# EAGLE design FBMiniLEDStrip (EAGLE 7.7.0)
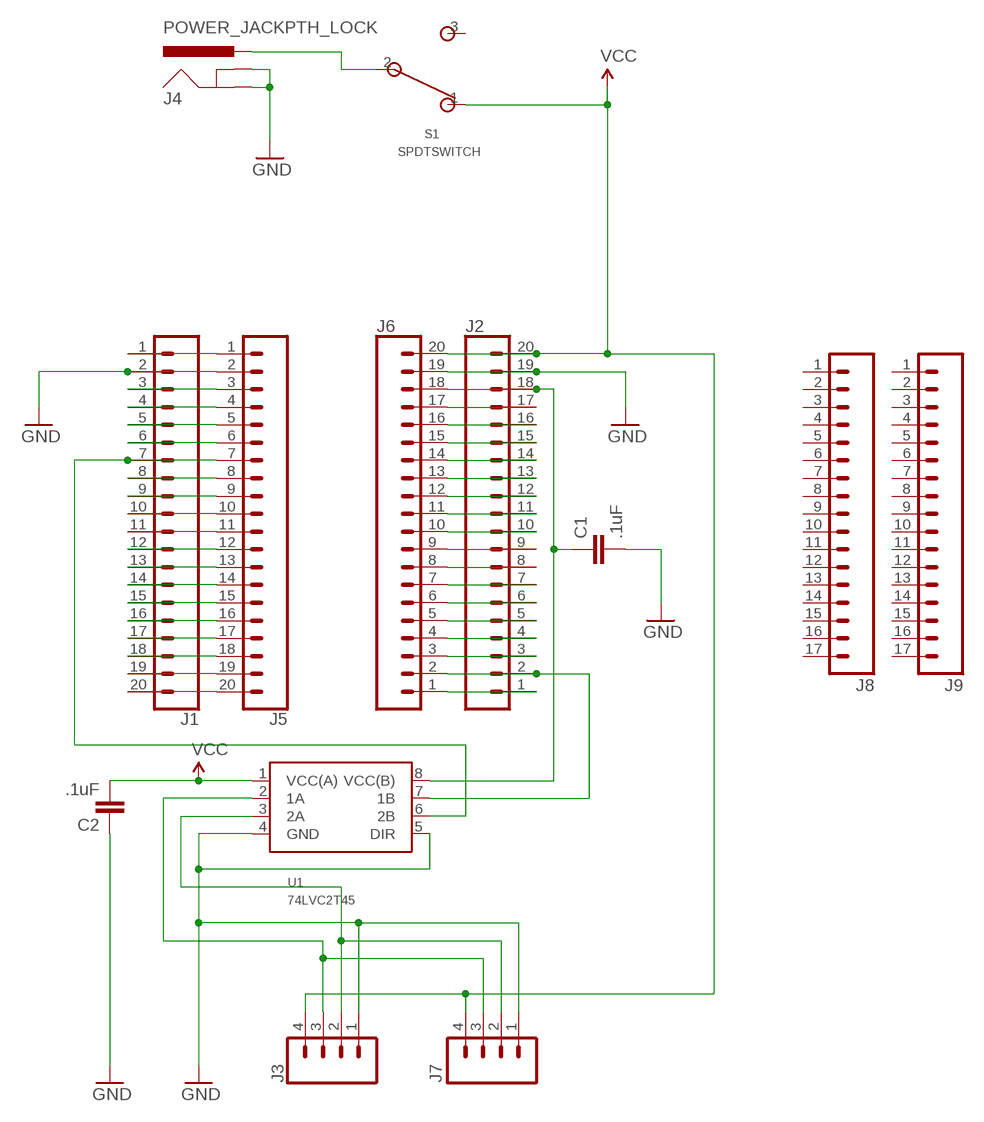
[diagram p0: schematic, sheet 1]

## Parts
C1  .1uF  CAP0603-CAP  [0603-CAP]
C2  .1uF  CAP0603-CAP  [0603-CAP]
J1  CONN_20  [1X20]
J2  CONN_20  [1X20]
J3  CONN_04SCREW  [SCREWTERMINAL-3.5MM-4@1]
J4  POWER_JACKPTH_LOCK  [POWER_JACK_PTH_LOCK]
J5  CONN_20  [1X20]
J6  CONN_20  [1X20]
J7  M04PTH  [1X04]
J8  M17  [1X17]
J9  M17  [1X17]
S1  SPDTSWITCH  [100SP1T1B4M2QE]
U1  74LVC2T45  [VSSOP8]

## Nets
GND: C1.2 C2.1 J1.2 J2.19 J3.1 J4.GND J4.GNDBREAK J5.2 J6.19 J7.1 U1.4(GND) U1.5(DIR)
N$3: J1.1 J5.1
N$4: J3.2 J7.2 U1.3(2A)
N$5: J1.3 J5.3
N$6: J1.4 J5.4
N$7: J1.5 J5.5
N$8: J1.6 J5.6
N$9: J1.7 J5.7 U1.6(2B)
N$10: J1.8 J5.8
N$11: J1.9 J5.9
N$12: J1.10 J5.10
N$13: J1.11 J5.11
N$14: J1.12 J5.12
N$15: J1.13 J5.13
N$16: J1.14 J5.14
N$17: J1.15 J5.15
N$18: J1.16 J5.16
N$19: J1.17 J5.17
N$20: J1.18 J5.18
N$21: J1.19 J5.19
N$22: J1.20 J5.20
N$23: J3.3 J7.3 U1.2(1A)
N$25: C1.1 J2.18 J6.18 U1.8(VCC(B))
N$26: J2.17 J6.17
N$27: J2.16 J6.16
N$28: J2.15 J6.15
N$29: J2.14 J6.14
N$30: J2.13 J6.13
N$31: J2.12 J6.12
N$32: J2.11 J6.11
N$33: J2.10 J6.10
N$34: J2.9 J6.9
N$35: J2.8 J6.8
N$36: J2.7 J6.7
N$37: J2.6 J6.6
N$38: J2.5 J6.5
N$39: J2.4 J6.4
N$40: J2.3 J6.3
N$41: J2.2 J6.2 U1.7(1B)
N$42: J2.1 J6.1
N$43: J4.PWR S1.2
VCC: C2.2 J2.20 J3.4 J6.20 J7.4 S1.1 U1.1(VCC(A))
Unconnected: J8.1 J8.2 J8.3 J8.4 J8.5 J8.6 J8.7 J8.8 J8.9 J8.10 J8.11 J8.12 J8.13 J8.14 J8.15 J8.16 J8.17 J9.1 J9.2 J9.3 J9.4 J9.5 J9.6 J9.7 J9.8 J9.9 J9.10 J9.11 J9.12 J9.13 J9.14 J9.15 J9.16 J9.17 S1.3

## Library data of the parts
C1 C2 = SparkFun-Capacitors:CAP: Capacitor Standard 0603 ceramic capacitor, and 0.1" leaded capacitor.
J1 J2 J5 J6 = SparkFun-Connectors:CONN_20: Multi connection point. Often used as Generic Header-pin footprint for 0.1 inch spaced/style header connections On any of the 0.1 inch spaced packages, you can populate with these: Break Away Headers - Straight <https://www.sparkfun.com/products/116> (PRT-00116) Break Away Male Headers - Right Angle <https://www.sparkfun.com/products/553> (PRT-00553) Female Headers <https://www.sparkfun.com/products/115> (PRT-00115) Break Away Headers - Machine Pin <https://www.sparkfun.com/products/117> (PRT-00117) Break Away Female Headers - Swiss Machine Pin <https://www.sparkfun.com/products/743> (PRT-00743) For SCREWTERMINALS and SPRING TERMINALS visit here: Screw Terimnals on SparkFun.com <https://www.sparkfun.com/search/results?term=Screw+Terminals> (5mm/3.5mm/2.54mm spacing) This device is also useful as a general connection point to wire up your design to another part of your project. Our various solder wires solder well into these plated through hole pads. Hook-Up Wire - Assortment (Stranded, 22 AWG) <https://www.sparkfun.com/products/11375> (PRT-11375) Hook-Up Wire - Assortment (Solid Core, 22 AWG) <https://www.sparkfun.com/products/11367> (PRT-11367) View the entire wire category on our website here <https://www.sparkfun.com/categories/141> Special notes: Molex polarized connector foot print use with SKU : PRT-08231 with associated crimp pins and housings. 1MM SMD Version SKU: PRT-10208 NOTES ON THE VARIANTS LOCK and LOCK_LONGPADS... This footprint was designed to help hold the alignment of a through-hole component (i.e. 6-pin header) while soldering it into place. You may notice that each hole has been shifted either up or down by 0.005 of an inch from it's more standard position (which is a perfectly straight line). This slight alteration caused the pins (the squares in the middle) to touch the edges of the holes. Because they are alternating, it causes a "brace" to hold the component in place. 0.005 has proven to be the perfect amount of "off-center" position when using our standard breakaway headers. Although looks a little odd when you look at the bare footprint, once you have a header in there, the alteration is very hard to notice. Also,if you push a header all the way into place, it is covered up entirely on the bottom side. Note about LOCK SPECIAL package: This is just like the LOCK variant in that the holes are staggared by 5 mil, but except for the last two holes. They are not altered from the "standard" footprint layout. This is used for a special purpose on the layout of our Graphic LCD Backpack. Make sure you want to use this device before selecting it for you project!
J3 = SparkFun-Connectors:CONN_04: Multi connection point. Often used as Generic Header-pin footprint for 0.1 inch spaced/style header connections On any of the 0.1 inch spaced packages, you can populate with these: Break Away Headers - Straight <https://www.sparkfun.com/products/116> (PRT-00116) Break Away Male Headers - Right Angle <https://www.sparkfun.com/products/553> (PRT-00553) Female Headers <https://www.sparkfun.com/products/115> (PRT-00115) Break Away Headers - Machine Pin <https://www.sparkfun.com/products/117> (PRT-00117) Break Away Female Headers - Swiss Machine Pin <https://www.sparkfun.com/products/743> (PRT-00743) For SCREWTERMINALS and SPRING TERMINALS visit here: Screw Terimnals on SparkFun.com <https://www.sparkfun.com/search/results?term=Screw+Terminals> (5mm/3.5mm/2.54mm spacing) This device is also useful as a general connection point to wire up your design to another part of your project. Our various solder wires solder well into these plated through hole pads. Hook-Up Wire - Assortment (Stranded, 22 AWG) <https://www.sparkfun.com/products/11375> (PRT-11375) Hook-Up Wire - Assortment (Solid Core, 22 AWG) <https://www.sparkfun.com/products/11367> (PRT-11367) View the entire wire category on our website here <https://www.sparkfun.com/categories/141> Special notes: Molex polarized connector foot print use with SKU : PRT-08231 with associated crimp pins and housings. 1MM SMD Version SKU: PRT-10208; PROD_ID: 2xCONN-08399; SF_ID: 2xPRT-08084
J4 = SparkFun-Connectors:POWER_JACK: Power Jack This is the standard 5.5mm barrel jack for power. The PTH is the most common, proven, reliable, footprint. The Slot footprint only works if the mill layer is transmitted to the PCB fab house so be warned. Mating wall wart : TOL-00298 (and others); PROD_ID: CONN-08197; SF_ID: PRT-00119
J7 = SparkFun-Connectors:M04: Header 4 Standard 4-pin 0.1" header. Use with straight break away headers (SKU : PRT-00116), right angle break away headers (PRT-00553), swiss pins (PRT-00743), machine pins (PRT-00117), and female headers (PRT-00115). Molex polarized connector foot print use with SKU : PRT-08231 with associated crimp pins and housings. 1MM SMD Version SKU: PRT-10208; PROD_ID: CONN-09696
J8 J9 = SparkFun-Connectors:M17: 1x17 .1" header
S1 = EG2355-ND_SPDT_Toggle:SPDTSWITCH
U1 = 74LVCH2T45DC:74LVC2T45

## Board
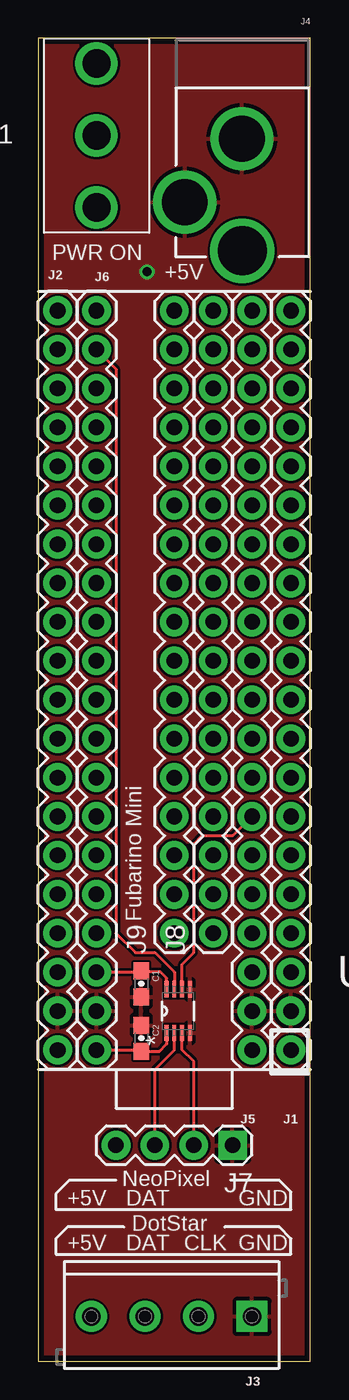
[diagram p1: board, top side]
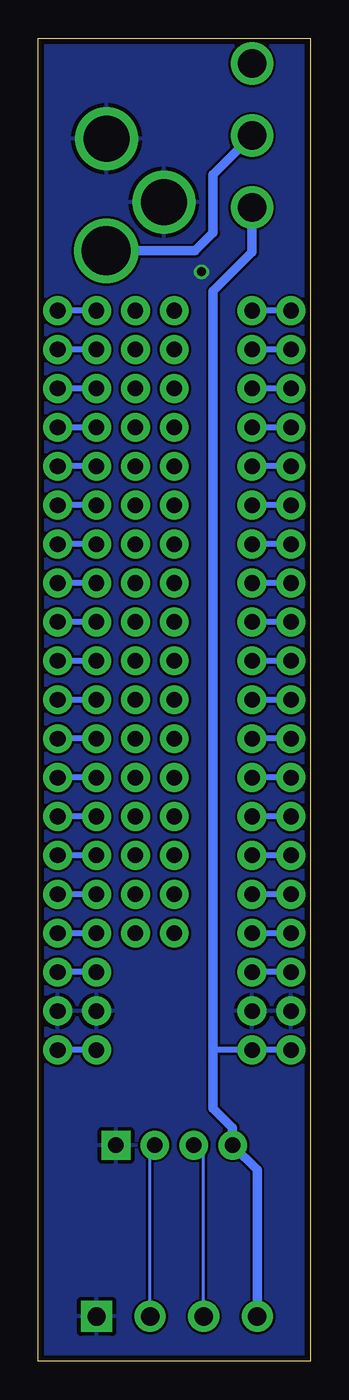
[diagram p2: board, bottom side, seen from below]

Size 17.78 x 86.36 mm. Coordinates in mm from the lower left corner, seen from the top.
Outline: 0,0 17.78,0 17.78,86.36 0,86.36 0,0
Copper layers (1*16): Top 0.0356mm / dielectric 1.5011mm / Bottom 0.0356mm
Design rules "oshpark-2layer-BPS": minimum track width 6mil, minimum drill 13mil, track to track 6mil, track to pad 6mil, pad to pad 6mil, via to via 6mil, smd to smd 6mil, copper to edge 15mil, drill to drill 6mil, minimum pad ring 7mil, minimum via ring 7mil, stop-mask expansion 2.5mil, vias tented up to drill 25mil, thermal gap 10mil

### Footprints (pad centres in the part's own frame; a part is rotated, then mirrored left to right if it is on the bottom)
0603-CAP = smd 1.1 x 1: 1 -0.85,0; 2 0.85,0
1X20 = drill 1.016 pad 1.88: 1 0,0; 2 2.54,0; 3 5.08,0; 4 7.62,0; 5 10.16,0; 6 12.7,0; 7 15.24,0; 8 17.78,0; 9 20.32,0; 10 22.86,0; 11 25.4,0; 12 27.94,0; 13 30.48,0; 14 33.02,0; 15 35.56,0; 16 38.1,0; 17 40.64,0; 18 43.18,0; 19 45.72,0; 20 48.26,0
SCREWTERMINAL-3.5MM-4@1 = drill 1.2 pad 2.032 square: 1 0,0 | drill 1.2 pad 2.032: 2 3.5,0; 3 7,0; 4 10.5,0
POWER_JACK_PTH_LOCK = drill 2.997 pad 4.115: GND 0.025,6.557; GNDBREAK 3.762,10.7 | drill 3.2 pad 4.115: PWR 0,13.878
1X04 = drill 1.016 pad 1.88 square: 1 0,0 | drill 1.016 pad 1.88: 2 2.54,0; 3 5.08,0; 4 7.62,0
1X17 = drill 1.016 pad 1.88: 1 0,0; 2 2.54,0; 3 5.08,0; 4 7.62,0; 5 10.16,0; 6 12.7,0; 7 15.24,0; 8 17.78,0; 9 20.32,0; 10 22.86,0; 11 25.4,0; 12 27.94,0; 13 30.48,0; 14 33.02,0; 15 35.56,0; 16 38.1,0; 17 40.64,0
100SP1T1B4M2QE = drill 1.85: 1 -4.7,0; 2 0,0; 3 4.7,0
VSSOP8 = smd 1.067 x 0.254: 1 -1.422,0.762; 2 -1.422,0.254; 3 -1.422,-0.254; 4 -1.422,-0.762; 5 1.422,-0.762; 6 1.422,-0.254; 7 1.422,0.254; 8 1.422,0.762

### Placement (x,y rotation side)
C1  6.73,24.64 270 top
C2  6.73,21.08 270 top
J1  16.51,20.32 90 top
J2  1.27,68.58 270 top
J3  13.97,2.92 180 top
J4  13.34,86.36 180 top
J5  13.97,20.32 90 top
J6  3.81,68.58 270 top
J7  12.7,14.1 180 top
J8  11.43,27.94 90 top
J9  8.89,27.94 90 top
S1  3.81,80.01 90 top
U1  9.14,22.86 90 top

### Tracks (layer width: path | path; a pad name or v marks a point on that pad's centre or on a via)
GND  (via drill 0.6)
  other vias: 7.11,71.12
  pour Top: 0,86.36 17.78,86.36 17.78,0 0,0
  pour Bottom: 0,86.36 17.78,86.36 17.78,0 0,0
N$3
  Bottom 0.406: J5.1 J1.1
N$4
  Top 0.203: J7.2 10.16,19.56 9.4,20.32 U1.3
  Bottom 0.203: J3.2 10.47,13.79 J7.2
N$5
  Bottom 0.406: J5.3 J1.3
N$6
  Bottom 0.406: J5.4 J1.4
N$7
  Bottom 0.406: J5.5 J1.5
N$8
  Bottom 0.406: J5.6 J1.6
N$9
  Top 0.203: J5.7 12.7,34.29 10.67,34.29 10.16,33.78 10.16,26.67 9.4,25.91 U1.6
  Bottom 0.406: J5.7 J1.7
N$10
  Bottom 0.406: J5.8 J1.8
N$11
  Bottom 0.406: J5.9 J1.9
N$12
  Bottom 0.406: J5.10 J1.10
N$13
  Bottom 0.406: J5.11 J1.11
N$14
  Bottom 0.406: J5.12 J1.12
N$15
  Bottom 0.406: J5.13 J1.13
N$16
  Bottom 0.406: J5.14 J1.14
N$17
  Bottom 0.406: J5.15 J1.15
N$18
  Bottom 0.406: J5.16 J1.16
N$19
  Bottom 0.406: J5.17 J1.17
N$20
  Bottom 0.406: J5.18 J1.18
N$21
  Bottom 0.406: J5.19 J1.19
N$22
  Bottom 0.406: J5.20 J1.20
N$23
  Top 0.203: J7.3 7.62,19.05 8.89,20.32 U1.2
  Bottom 0.203: J3.3 6.97,13.45 J7.3
N$25
  Top 0.203: J6.18 6.64,25.4 C1.1 6.82,25.4 8,25.4 8.38,25.02 U1.8
  Bottom 0.406: J2.18 J6.18
N$26
  Bottom 0.406: J2.17 J6.17
N$27
  Bottom 0.406: J2.16 J6.16
N$28
  Bottom 0.406: J2.15 J6.15
N$29
  Bottom 0.406: J2.14 J6.14
N$30
  Bottom 0.406: J2.13 J6.13
N$31
  Bottom 0.406: J2.12 J6.12
N$32
  Bottom 0.406: J2.11 J6.11
N$33
  Bottom 0.406: J2.10 J6.10
N$34
  Bottom 0.406: J2.9 J6.9
N$35
  Bottom 0.406: J2.8 J6.8
N$36
  Bottom 0.406: J2.7 J6.7
N$37
  Bottom 0.406: J2.6 J6.6
N$38
  Bottom 0.406: J2.5 J6.5
N$39
  Bottom 0.406: J2.4 J6.4
N$40
  Bottom 0.406: J2.3 J6.3
N$41
  Top 0.203: J6.2 5.08,64.77 5.08,27.94 6.35,26.67 7.62,26.67 8.89,25.4 U1.7
  Bottom 0.406: J2.2 J6.2
N$42
  Bottom 0.406: J2.1 J6.1
N$43
  Bottom 0.61: J4.PWR 7.53,72.48 6.35,73.66 6.35,77.47 S1.2
VCC
  Top 0.203: J6.20 6.64,20.32 C2.2 7.91,20.23 8.38,20.7 U1.1
  Bottom 0.406: J2.20 J6.20 6.35,20.32
  Bottom 0.61: S1.1 3.81,72.39 6.35,69.85 6.35,20.32 6.35,16.51 5.08,15.24 J7.4 3.47,12.49 J3.4

### Text on the board
tPlace: PWR ON | +5V | Fubarino Mini | NeoPixel | +5V | DAT | GND | DotStar | +5V | DAT | CLK | GND